# EAGLE schematic Blank Ext Board (EAGLE 6.4)
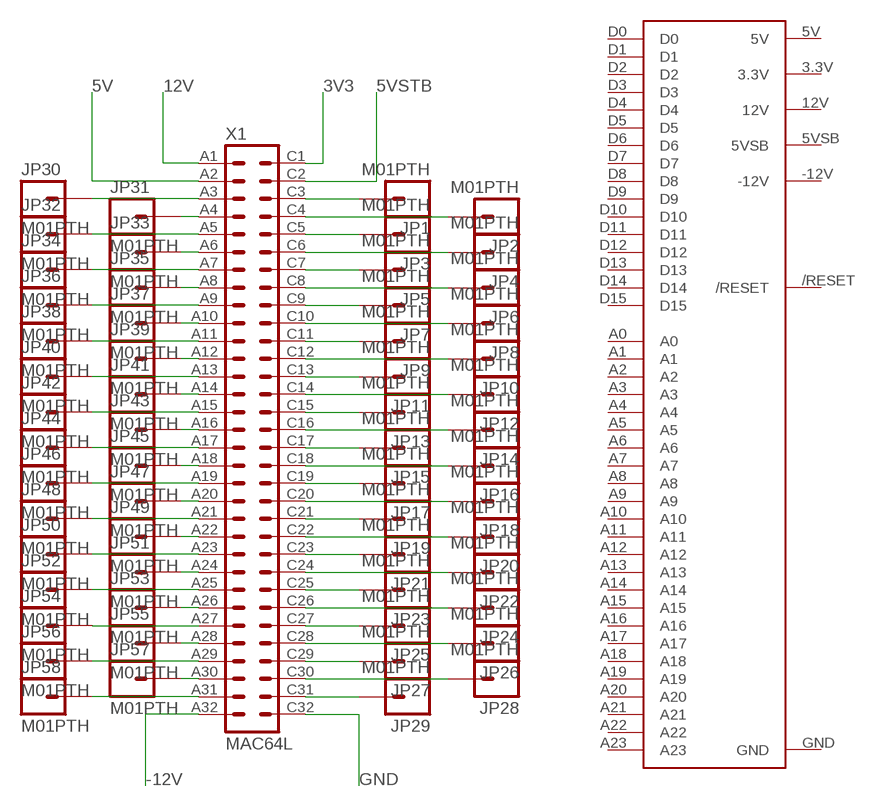
[diagram p0: schematic, sheet 1]

## Parts
JP1  M01PTH  [1X01]
JP2  M01PTH  [1X01]
JP3  M01PTH  [1X01]
JP4  M01PTH  [1X01]
JP5  M01PTH  [1X01]
JP6  M01PTH  [1X01]
JP7  M01PTH  [1X01]
JP8  M01PTH  [1X01]
JP9  M01PTH  [1X01]
JP10  M01PTH  [1X01]
JP11  M01PTH  [1X01]
JP12  M01PTH  [1X01]
JP13  M01PTH  [1X01]
JP14  M01PTH  [1X01]
JP15  M01PTH  [1X01]
JP16  M01PTH  [1X01]
JP17  M01PTH  [1X01]
JP18  M01PTH  [1X01]
JP19  M01PTH  [1X01]
JP20  M01PTH  [1X01]
JP21  M01PTH  [1X01]
JP22  M01PTH  [1X01]
JP23  M01PTH  [1X01]
JP24  M01PTH  [1X01]
JP25  M01PTH  [1X01]
JP26  M01PTH  [1X01]
JP27  M01PTH  [1X01]
JP28  M01PTH  [1X01]
JP29  M01PTH  [1X01]
JP30  M01PTH  [1X01]
JP31  M01PTH  [1X01]
JP32  M01PTH  [1X01]
JP33  M01PTH  [1X01]
JP34  M01PTH  [1X01]
JP35  M01PTH  [1X01]
JP36  M01PTH  [1X01]
JP37  M01PTH  [1X01]
JP38  M01PTH  [1X01]
JP39  M01PTH  [1X01]
JP40  M01PTH  [1X01]
JP41  M01PTH  [1X01]
JP42  M01PTH  [1X01]
JP43  M01PTH  [1X01]
JP44  M01PTH  [1X01]
JP45  M01PTH  [1X01]
JP46  M01PTH  [1X01]
JP47  M01PTH  [1X01]
JP48  M01PTH  [1X01]
JP49  M01PTH  [1X01]
JP50  M01PTH  [1X01]
JP51  M01PTH  [1X01]
JP52  M01PTH  [1X01]
JP53  M01PTH  [1X01]
JP54  M01PTH  [1X01]
JP55  M01PTH  [1X01]
JP56  M01PTH  [1X01]
JP57  M01PTH  [1X01]
JP58  M01PTH  [1X01]
U$3  BACKPLANEBOARD  [BACKPLANEBOARD]
X1  MAC64L  [MAC64L]

## Nets
3V3: X1.C1
5V: X1.A2
5VSTB: X1.C2
12V: X1.A1
-12V: X1.A32
GND: X1.C32
N$156: JP58.1 X1.A31
N$208: JP29.1 X1.C31
N$260: JP57.1 X1.A30
N$312: JP28.1 X1.C30
N$364: JP56.1 X1.A29
N$416: JP27.1 X1.C29
N$468: JP55.1 X1.A28
N$520: JP26.1 X1.C28
N$572: JP54.1 X1.A27
N$624: JP25.1 X1.C27
N$676: JP53.1 X1.A26
N$728: JP24.1 X1.C26
N$780: JP52.1 X1.A25
N$832: JP23.1 X1.C25
N$884: JP51.1 X1.A24
N$936: JP22.1 X1.C24
N$988: JP50.1 X1.A23
N$1040: JP21.1 X1.C23
N$1092: JP49.1 X1.A22
N$1144: JP20.1 X1.C22
N$1196: JP48.1 X1.A21
N$1248: JP19.1 X1.C21
N$1300: JP47.1 X1.A20
N$1352: JP18.1 X1.C20
N$1404: JP46.1 X1.A19
N$1456: JP17.1 X1.C19
N$1508: JP45.1 X1.A18
N$1560: JP16.1 X1.C18
N$1612: JP44.1 X1.A17
N$1613: JP15.1 X1.C17
N$1664: JP14.1 X1.C16
N$1665: JP43.1 X1.A16
N$1666: JP13.1 X1.C15
N$1667: JP42.1 X1.A15
N$1668: JP12.1 X1.C14
N$1669: JP41.1 X1.A14
N$1670: JP11.1 X1.C13
N$1671: JP40.1 X1.A13
N$1672: JP10.1 X1.C12
N$1673: JP39.1 X1.A12
N$1674: JP9.1 X1.C11
N$1675: JP38.1 X1.A11
N$1676: JP8.1 X1.C10
N$1677: JP37.1 X1.A10
N$1678: JP7.1 X1.C9
N$1679: JP36.1 X1.A9
N$1680: JP6.1 X1.C8
N$1681: JP35.1 X1.A8
N$1682: JP5.1 X1.C7
N$1683: JP34.1 X1.A7
N$1684: JP4.1 X1.C6
N$1685: JP33.1 X1.A6
N$1686: JP3.1 X1.C5
N$1687: JP32.1 X1.A5
N$1688: JP2.1 X1.C4
N$1689: JP31.1 X1.A4
N$1690: JP1.1 X1.C3
N$1691: JP30.1 X1.A3
Unconnected: U$3.3.3V U$3.5V U$3.5VSB U$3.12V U$3.-12V U$3./RESET U$3.A0 U$3.A1 U$3.A2 U$3.A3 U$3.A4 U$3.A5 U$3.A6 U$3.A7 U$3.A8 U$3.A9 U$3.A10 U$3.A11 U$3.A12 U$3.A13 U$3.A14 U$3.A15 U$3.A16 U$3.A17 U$3.A18 U$3.A19 U$3.A20 U$3.A21 U$3.A22 U$3.A23 U$3.D0 U$3.D1 U$3.D2 U$3.D3 U$3.D4 U$3.D5 U$3.D6 U$3.D7 U$3.D8 U$3.D9 U$3.D10 U$3.D11 U$3.D12 U$3.D13 U$3.D14 U$3.D15 U$3.GND

## Library data of the parts
JP1-JP58 = SparkFun-Connectors:M01: Header 1 Standard 1-pin 0.1" header. Use with straight break away headers (SKU : PRT-00116), right angle break away headers (PRT-00553), swiss pins (PRT-00743), machine pins (PRT-00117), and female headers (PRT-00115).
U$3 = Benchoff:BACKPLANEBOARD
X1 = con-vg:MAC64L: CONNECTOR male, 64 pins, block, type C, rows AC, grid 5.08 mm